# Altium project STM32F401CCU6.PrjPCB
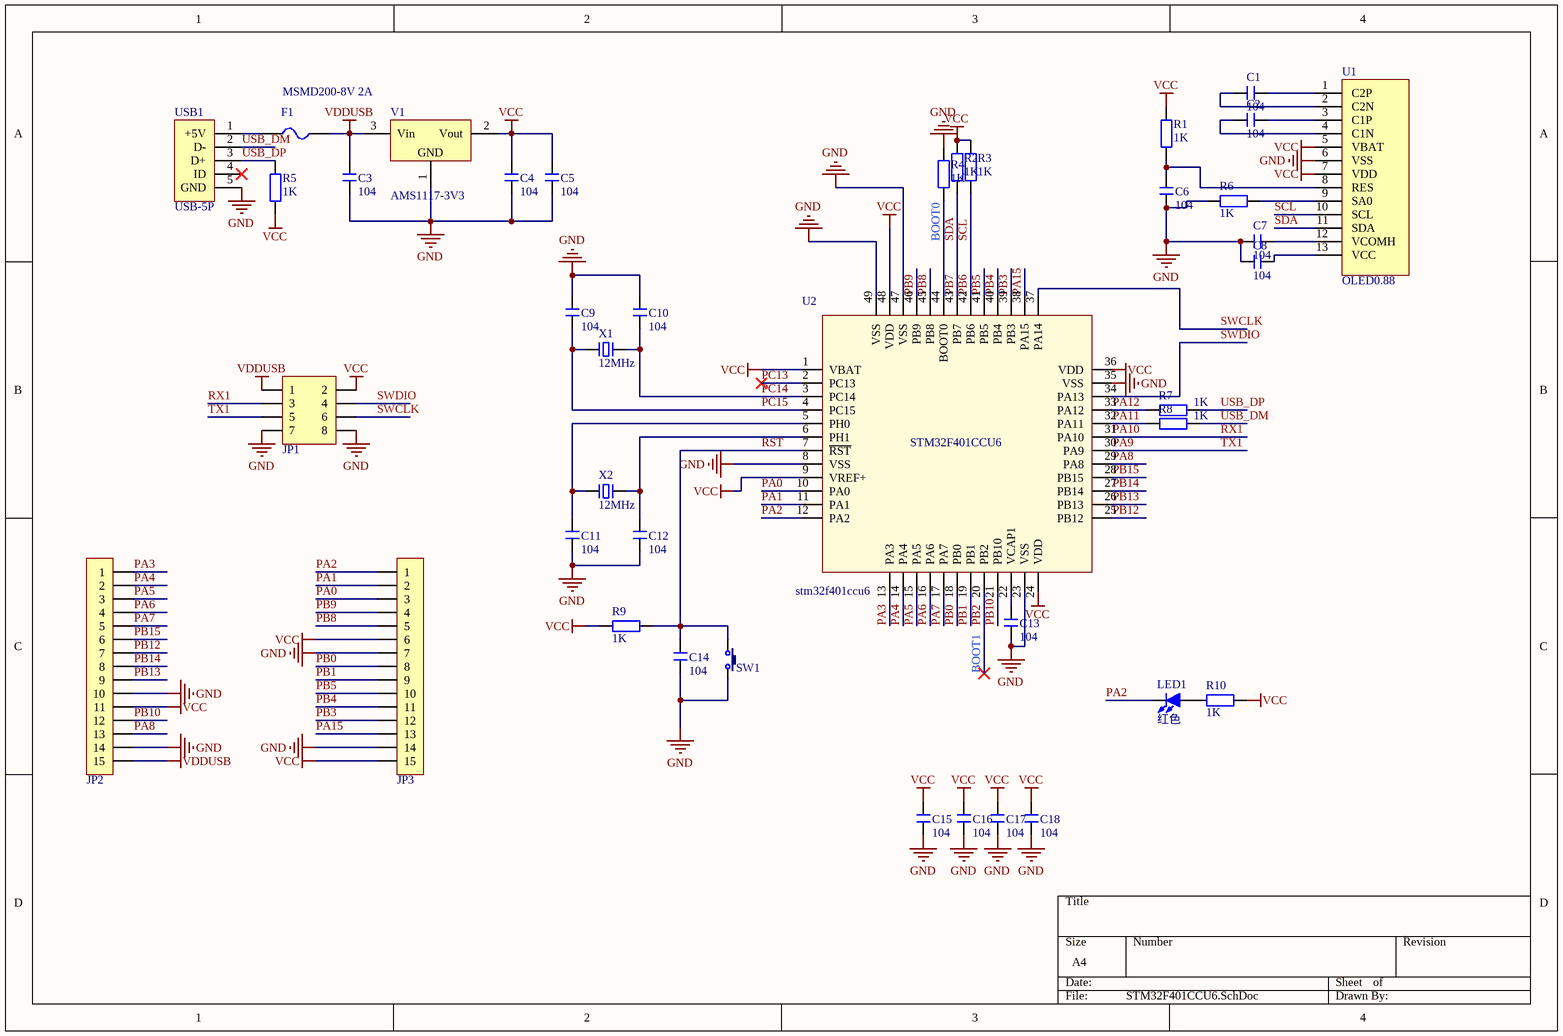
[diagram p0: STM32F401CCU6.SchDoc]
1 sheet, 40 parts. Net scope: global (net labels, ports and power ports of the same name join across sheets).
Board files: STM32F401CCU6.PcbDoc, 拼版.PcbDoc

## Sheet STM32F401CCU6.SchDoc
size A4

### Parts
C1  104  [C 0603_L]
C2  104  [C 0603_L]
C3  104  [C 0805_L]
C4  104  [C 0603_L]
C5  104  [C 0603_L]
C6  104  [C 0603_L]
C7  104  [C 0603_L]
C8  104  [C 0603_L]
C9  104  [C 0603_L]
C10  104  [C 0603_L]
C11  104  [C 0603_L]
C12  104  [C 0603_L]
C13  104  [C 0603_L]
C14  104  [C 0603_L]
C15  104  [C 0603_L]
C16  104  [C 0603_L]
C17  104  [C 0603_L]
C18  104  [C 0603_L]
F1  MSMD200-8V 2A  [FU 0603]
JP1  Header 4X2  [HDR2.54-WI-2x4P]  (value not drawn)
JP2  HDR-1X15  [HDR2.54-LI-15P]  (value not drawn)
JP3  HDR-1X15  [HDR2.54-LI-15P]  (value not drawn)
LED1  红色  [LED 0603Y]
R1  1K  [R 0603_L]
R2  1K  [R 0603_L]
R3  1K  [R 0603_L]
R4  1K  [R 0603_L]
R5  1K  [R 0603_L]
R6  1K  [R 0603_L]
R7  1K  [R 0603_L]
R8  1K  [R 0603_L]
R9  1K  [R 0603_L]
R10  1K  [R 0603_L]
SW1  3x6x5  [TSW 3*4*2-S-W]  (value not drawn)
U1  OLED0.88  [OLED088]
U2  stm32f401ccu6  [QFN48 7X7_L]
USB1  USB-5P  [USB-MICRO_A]
V1  AMS1117-3V3  [SOT223_L]
X1  12MHz  [OSC 3215-2P]
X2  12MHz  [OSC 5032-2P]

### Nets
GND: C3.1 C4.1 C5.1 C6.1 C7.1 C8.1 C9.2 C10.2 C11.1 C12.1 C13.1 C14.1 C15.1 C16.1 C17.1 C18.1 JP1.7 JP1.8 JP2.10 JP2.14 JP3.7 JP3.14 R4.2 R6.1 SW1.2 U1.6(VSS) U2.8(VSS) U2.23(VSS) U2.35(VSS) U2.47(VSS) U2.49(VSS) USB1.5(GND) V1.1(GND)
VCC: C4.2 C5.2 C15.2 C16.2 C17.2 C18.2 JP1.2 JP2.11 JP3.6 JP3.15 R1.1 R2.2 R3.2 R5.1 R9.1 R10.2 U1.5(VBAT) U1.7(VDD) U2.1(VBAT) U2.9(VREF+) U2.24(VDD) U2.36(VDD) U2.48(VDD) V1.2(Vout)
VDDUSB: C3.2 F1.2 JP1.1 JP2.15 V1.3(Vin)
BOOT0: R4.1 U2.44(BOOT0)
BOOT1: U2.20(PB2)  [also labelled PB2]
PA0: JP3.3 U2.10(PA0)
PA1: JP3.2 U2.11(PA1)
PA2: JP3.1 LED1.2(K) U2.12(PA2)
PA3: JP2.1 U2.13(PA3)
PA4: JP2.2 U2.14(PA4)
PA5: JP2.3 U2.15(PA5)
PA6: JP2.4 U2.16(PA6)
PA7: JP2.5 U2.17(PA7)
PA8: JP2.13 U2.29(PA8)
PA9: JP1.5 U2.30(PA9)  [also labelled TX1]
PA10: JP1.3 U2.31(PA10)  [also labelled RX1]
PA11: R8.1 U2.32(PA11)
PA12: R7.1 U2.33(PA12)
PA15: JP3.13 U2.38(PA15)
PB0: JP3.8 U2.18(PB0)
PB1: JP3.9 U2.19(PB1)
PB3: JP3.12 U2.39(PB3)
PB4: JP3.11 U2.40(PB4)
PB5: JP3.10 U2.41(PB5)
PB6: R3.1 U1.10(SCL) U2.42(PB6)  [also labelled SCL]
PB7: R2.1 U1.11(SDA) U2.43(PB7)  [also labelled SDA]
PB8: JP3.5 U2.45(PB8)
PB9: JP3.4 U2.46(PB9)
PB10: JP2.12 U2.21(PB10)
PB12: JP2.7 U2.25(PB12)
PB13: JP2.9 U2.26(PB13)
PB14: JP2.8 U2.27(PB14)
PB15: JP2.6 U2.28(PB15)
PC13: U2.2(PC13)
PC14: C10.1 U2.3(PC14) X1.2
PC15: C9.1 U2.4(PC15) X1.1
RST: C14.2 R9.2 SW1.1 U2.7(~{RST})
SWCLK: JP1.6 U2.37(PA14)
SWDIO: JP1.4 U2.34(PA13)
USB_DM: R8.2 USB1.2(D-)
USB_DP: R5.2 R7.2 USB1.3(D+)
NetC1_1: C1.1 U1.2(C2N)
NetC1_2: C1.2 U1.1(C2P)
NetC2_1: C2.1 U1.4(C1N)
NetC2_2: C2.2 U1.3(C1P)
NetC6_2: C6.2 R1.2 U1.8(RES)
NetC7_2: C7.2 U1.12(VCOMH)
NetC8_2: C8.2 U1.13(VCC)
NetC11_2: C11.2 U2.5(PH0) X2.1
NetC12_2: C12.2 U2.6(PH1) X2.2
NetC13_2: C13.2 U2.22(VCAP1)
NetF1_1: F1.1 USB1.1(+5V)
NetLED1_1: LED1.1(A) R10.1
NetR6_2: R6.2 U1.9(SA0)

Not connected (* = marked no-connect by the designer): USB1 4(ID)*

### Notes on the sheet
- (in symbol stm32f401ccu6) STM32F401CCU6

### Library data of the parts
C1-C18 = C: 无极性贴片电容; 版权归属: 源创客; BOM名称: 无极性贴片电容; 学习资源: www.ooocke.com
F1 = FU: 贴片保险丝; 版权归属: 源创客; BOM名称: 贴片保险丝; 学习资源: www.ooocke.com
JP1 = Header 4X2: 4*2P接插件; 版权归属: 源创客; BOM名称: 4*2P接插件; 学习资源: www.ooocke.com
JP2 JP3 = Header 15: 15P接插件; 版权归属: 源创客; BOM名称: 15P接插件; 学习资源: www.ooocke.com
LED1 = LED-SMD: 贴片LED; 版权归属: 源创客; BOM名称: 贴片LED; 学习资源: www.ooocke.com
R1-R10 = R: 贴片电阻; 版权归属: 源创客; BOM名称: 贴片电阻; 学习资源: www.ooocke.com
SW1 = TSW 3x6: 3x6轻触开关; 版权归属: 源创客; BOM名称: 3x6轻触开关; 学习资源: www.ooocke.com
U1 = OLED0.88: 0.88寸oled 128*32
USB1 = USB-5P: 微型USB母座; 版权归属: 源创客; BOM名称: 微型USB母座; 学习资源: www.ooocke.com
V1 = AMS1117: 三端稳压芯片; BOM名称: 稳压芯片; 版权归属: 源创客; 学习资源: www.ooocke.com
X1 X2 = XTAL-2P: 2脚无源脚晶振; 版权归属: 源创客; BOM名称: 2脚无源脚晶振; 学习资源: www.ooocke.com